# EAGLE design musicbox (EAGLE 9.6.2)
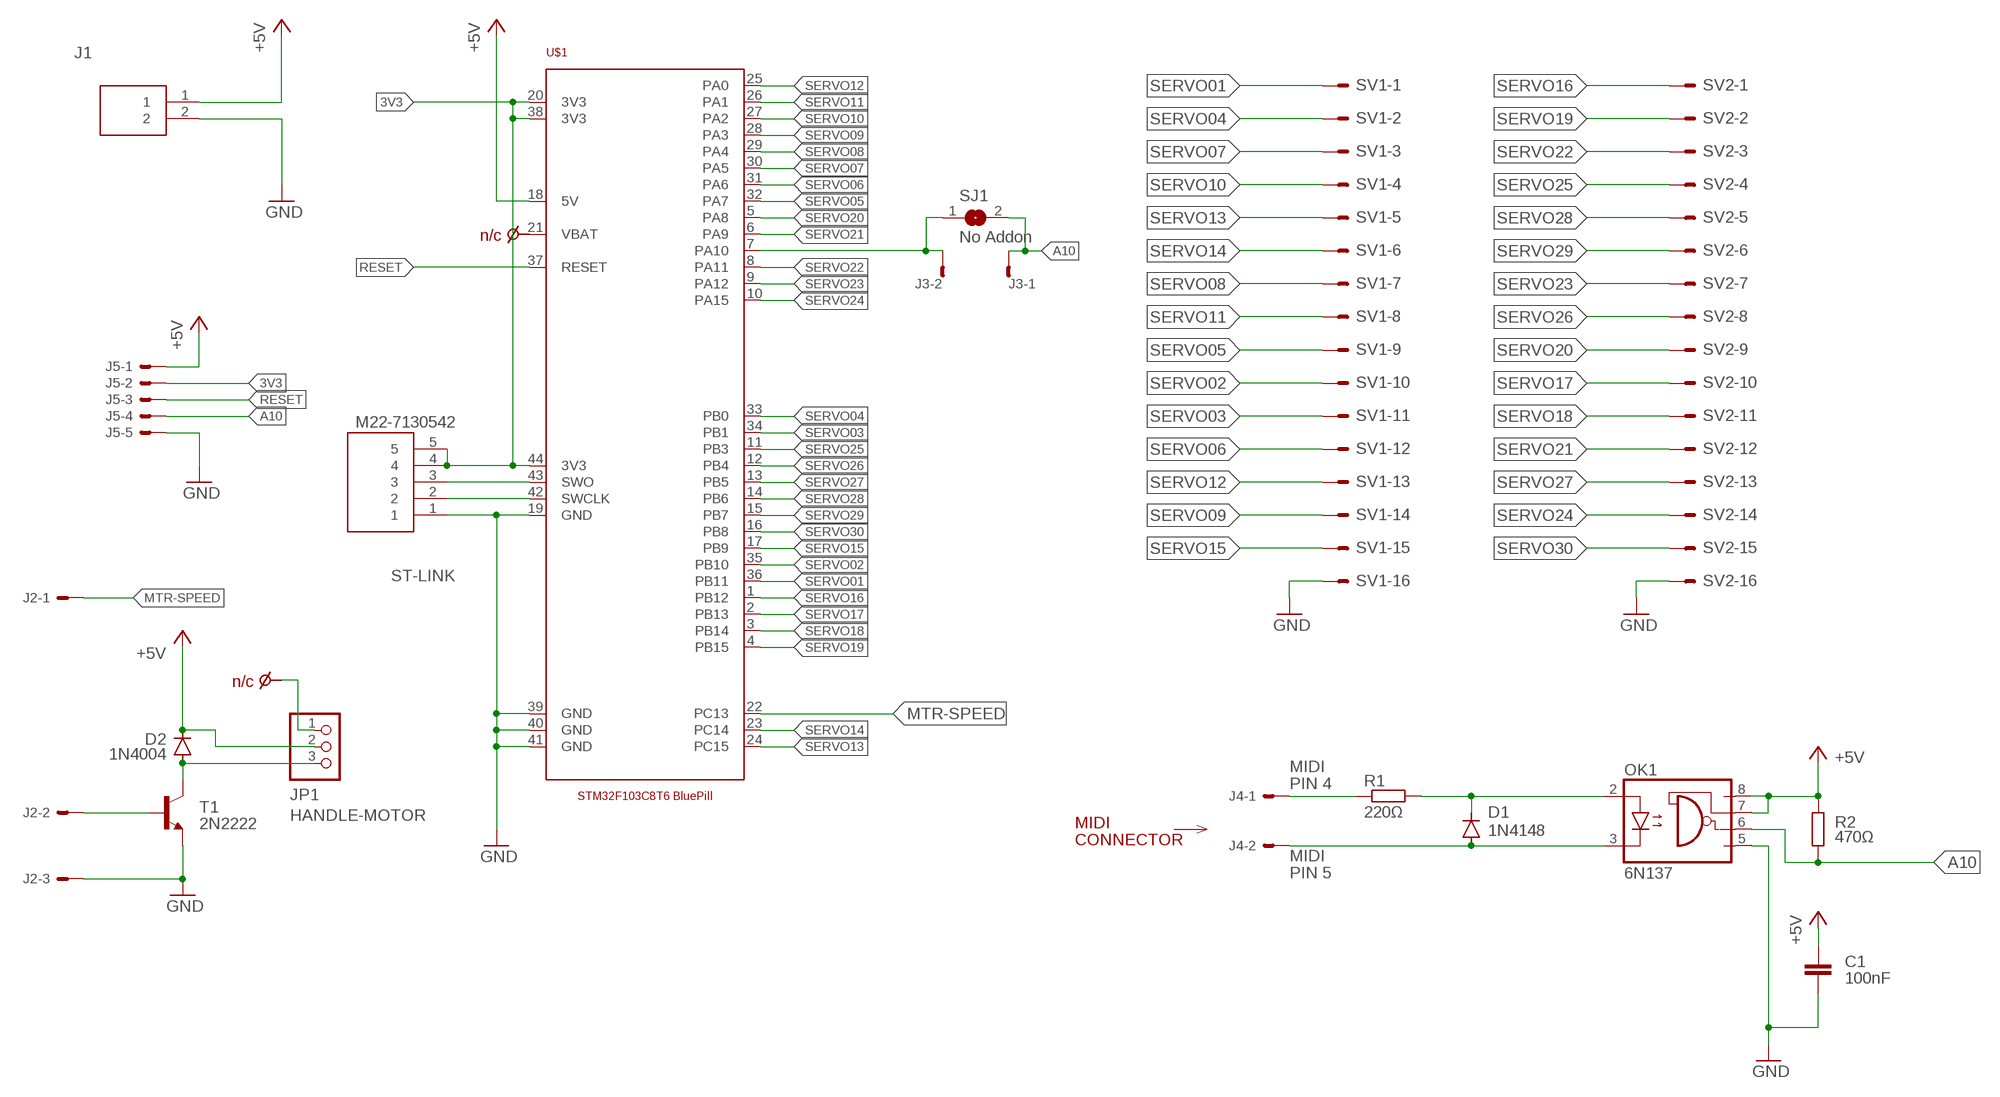
[diagram p0: schematic, sheet 1]

## Parts
C1  100nF  C-EU025-025X050  [C025-025X050]
D1  1N4148  1N4148DO35-7  [DO35-7]
D2  1N4004  [DO41-10]
J1  1727010  [1727010]
J2  22-27-2031-03  [6410-03]
J3  22-27-2021-02  [6410-02]
J4  22-27-2021-02  [6410-02]
J5  22-27-2051-05  [6410-05]
JP1  HANDLE-MOTOR  PINHD-1X3  [1X03]
OK1  6N137  [DIL08]
R1  220Ω  R-EU_0207/7  [0207/7]
R2  470Ω  R-EU_0207/7  [0207/7]
SJ1  No Addon  SJW  [SJW]
ST-LINK  M22-7130542  [RHDR5W50P0X200_1X5_1050X240X44]
SV1  Servos 01-15  ML16E  [ML16]
SV2  Servos 16-30  ML16E  [ML16]
T1  2N2222  2N3904  [TO92]
U$1  STM32F103C8T6BLUEPILL  [STM32F103C8T6]
U$3  N/C-ALT-WITH-TEXT  (no package)
U$5  N/C-ALT-WITH-TEXT  (no package)

## Nets
3V3: J5.2 ST-LINK.4 ST-LINK.5 U$1.20(3V3) U$1.38(3V3) U$1.44(3V3)
+5V: C1.1 D2.C J1.1 J5.1 JP1.2 OK1.7(VE) OK1.8(VCC) R2.2 U$1.18(5V)
A10: J3.1 J5.4 OK1.6(VO) R2.1 SJ1.2
CLK: ST-LINK.2 U$1.42(SWCLK)
DIO: ST-LINK.3 U$1.43(SWO)
GND: C1.2 J1.2 J2.3 J5.5 OK1.5(GND) ST-LINK.1 SV1.16 SV2.16 T1.3(E) U$1.19(GND) U$1.39(GND) U$1.40(GND) U$1.41(GND)
MTR-SPEED: J2.1 U$1.22(PC13)
N$1: J2.2 T1.2(B)
N$2: J4.1 R1.1
N$3: D2.A JP1.3 T1.1(C)
N$4: JP1.1 U$3.P$1
N$5: D1.A J4.2 OK1.3(C)
N$7: D1.C OK1.2(A) R1.2
N$9: U$1.21(VBAT) U$5.P$1
N$15: J3.2 SJ1.1 U$1.7(PA10)
RESET: J5.3 U$1.37(RESET)
SERVO01: SV1.1 U$1.36(PB11)
SERVO02: SV1.10 U$1.35(PB10)
SERVO03: SV1.11 U$1.34(PB1)
SERVO04: SV1.2 U$1.33(PB0)
SERVO05: SV1.9 U$1.32(PA7)
SERVO06: SV1.12 U$1.31(PA6)
SERVO07: SV1.3 U$1.30(PA5)
SERVO08: SV1.7 U$1.29(PA4)
SERVO09: SV1.14 U$1.28(PA3)
SERVO10: SV1.4 U$1.27(PA2)
SERVO11: SV1.8 U$1.26(PA1)
SERVO12: SV1.13 U$1.25(PA0)
SERVO13: SV1.5 U$1.24(PC15)
SERVO14: SV1.6 U$1.23(PC14)
SERVO15: SV1.15 U$1.17(PB9)
SERVO16: SV2.1 U$1.1(PB12)
SERVO17: SV2.10 U$1.2(PB13)
SERVO18: SV2.11 U$1.3(PB14)
SERVO19: SV2.2 U$1.4(PB15)
SERVO20: SV2.9 U$1.5(PA8)
SERVO21: SV2.12 U$1.6(PA9)
SERVO22: SV2.3 U$1.8(PA11)
SERVO23: SV2.7 U$1.9(PA12)
SERVO24: SV2.14 U$1.10(PA15)
SERVO25: SV2.4 U$1.11(PB3)
SERVO26: SV2.8 U$1.12(PB4)
SERVO27: SV2.13 U$1.13(PB5)
SERVO28: SV2.5 U$1.14(PB6)
SERVO29: SV2.6 U$1.15(PB7)
SERVO30: SV2.15 U$1.16(PB8)

## Notes on the sheet
- MIDI
  PIN 4
- MIDI
  CONNECTOR
- MIDI
  PIN 5

## Library data of the parts
C1 = rcl:C-EU: CAPACITOR, European symbol; DIGIKEY_PART_NUMBER: BC5142-ND; FARNELL_PART_NUMBER: 2112909; MANUFACTURER_NAME: Vishay / BC Components; MOUSER_PART_NUMBER: 594-K104M15X7RF53L2; SPICEPREFIX: C
D1 = diode:1N4148: DIODE high speed (Philips); DIGIKEY_PART_NUMBER: 1N4148FS-ND; FARNELL_PART_NUMBER: 2322485; MANUFACTURER_NAME: Onsemi / Fairchild; MOUSER_PART_NUMBER: 512-1N4148
D2 = diode:1N4004: DIODE general purpose rectifier, 1 A; DIGIKEY_PART_NUMBER: 1N4004MSCT-ND; FARNELL_PART_NUMBER: 1843708; MANUFACTURER_NAME: Rectron; MOUSER_PART_NUMBER: 583-1N4004-T
J1 = 1727010:1727010: Conn PC Terminal Block 2 POS 3.81mm Solder ST Thru-Hole 13.5A Source: Datasheet <https://datasheet.datasheetarchive.com/originals/distributors/SFDatasheet-2/sf-00050638.pdf>; ARROW_PART_NUMBER: 1727010; ARROW_PRICE-STOCK: https://www.arrow.com/en/products/1727010/phoenix-contact?region=nac; DESCRIPTION: Conn PC Terminal Block 2 POS 3.81mm Solder ST Thru-Hole 13.5A; DIGIKEY_PART_NUMBER: 277-1947-ND; FARNELL_PART_NUMBER: 3704579; HEIGHT: 8.65mm; MANUFACTURER_NAME: Phoenix Contact; MANUFACTURER_PART_NUMBER: 1727010; MOUSER_PART_NUMBER: 651-1727010; MOUSER_PRICE-STOCK: https://www.mouser.co.uk/ProductDetail/Phoenix-Contact/1727010?qs=JcjeNNoqGSMjtHhQoBJ7UA%3D%3D
J2 = con-molex:22-?-03: CONNECTOR wire to board 2.54 mm (.1 inch) pitch header; DIGIKEY_PART_NUMBER: WM4112-ND; FARNELL_PART_NUMBER: 9731156; MANUFACTURER_NAME: Molex; MF: MOLEX; MOUSER_PART_NUMBER: 538-22-27-2031; OC_FARNELL: unknown; OC_NEWARK: unknown
J3 J4 = con-molex:22-?-02: CONNECTOR wire to board 2.54 mm (.1 inch) pitch header; DIGIKEY_PART_NUMBER: WM4111-ND; FARNELL_PART_NUMBER: 9731148; MANUFACTURER_NAME: Molex; MF: MOLEX; MOUSER_PART_NUMBER: 538-22-27-2021; OC_FARNELL: unknown; OC_NEWARK: unknown
J5 = con-molex:22-?-05: CONNECTOR wire to board 2.54 mm (.1 inch) pitch header; DIGIKEY_PART_NUMBER: WM4114-ND; FARNELL_PART_NUMBER: 9731679; MANUFACTURER_NAME: Molex; MF: MOLEX; MOUSER_PART_NUMBER: 538-22-27-2051; OC_FARNELL: unknown; OC_NEWARK: unknown
JP1 = pinhead:PINHD-1X3: PIN HEADER; DIGIKEY_PART_NUMBER: 68004-403-ND; FARNELL_PART_NUMBER: 3881564; MANUFACTURER_NAME: Amphenol FCI; MOUSER_PART_NUMBER: 651-1012937890301BLF
OK1 = optocoupler:6N137: MOTOROLA OPTO COUPLER; DIGIKEY_PART_NUMBER: 160-1791-ND; FARNELL_PART_NUMBER: 1328376; MANUFACTURER_NAME: Lite-On; MOUSER_PART_NUMBER: 859-6N137; MPN: 6N137; OC_FARNELL: 1328376; OC_NEWARK: 52M1895
R1 = rcl:R-EU_: RESISTOR, European symbol; DIGIKEY_PART_NUMBER: BC3666CT-ND; FARNELL_PART_NUMBER: 3546954; MANUFACTURER_NAME: Vishay / Beyschlag; MOUSER_PART_NUMBER: 594-MBB02070C2200FCT; SPICEPREFIX: R
R2 = rcl:R-EU_: RESISTOR, European symbol; DIGIKEY_PART_NUMBER: BC3790CT-ND; FARNELL_PART_NUMBER: 3547014; MANUFACTURER_NAME: Vishay / Beyschlag; MOUSER_PART_NUMBER: 594-MBB02070C4700FCT; SPICEPREFIX: R
SJ1 = jumper:SJ: SMD solder JUMPER
ST-LINK = M22-7130542:M22-7130542: 2mm pitch, SIL vertical socket assembly, 5 position Source: Datasheet <https://cdn.harwin.com/pdfs/M22-713.pdf>; DESCRIPTION: 2mm pitch, SIL vertical socket assembly, 5 position; DIGIKEY_PART_NUMBER: 952-1352-5-ND; FARNELL_PART_NUMBER: 1109729; HEIGHT: 4.4mm; MANUFACTURER_NAME: Harwin; MANUFACTURER_PART_NUMBER: M22-7130542; MOUSER_PART_NUMBER: 855-M22-7130542; MOUSER_PRICE-STOCK: https://www.mouser.co.uk/ProductDetail/Harwin/M22-7130542?qs=Jph8NoUxIfVEgwGbmzmPjA%3D%3D
SV1 SV2 = con-harting-ml:ML16?E: HARTING; DIGIKEY_PART_NUMBER: 1195-1694-ND; FARNELL_PART_NUMBER: 1106834; MANUFACTURER_NAME: Harting; MOUSER_PART_NUMBER: 617-09185166324; OC_FARNELL: unknown; OC_NEWARK: unknown
T1 = transistor-neu-to92:2N3904: NPN TRANSISTOR; DIGIKEY_PART_NUMBER: KSP2222ABUFS-ND; FARNELL_PART_NUMBER: 1700711; MANUFACTURER_NAME: Diotec Semiconductors; MOUSER_PART_NUMBER: 637-2N2222A
U$1 = STM32F103C8T6-Blue_Pill:STM32F103C8T6
U$3 U$5 = nc-pin:N/C-ALT-WITH-TEXT: N/C Symbol With Label With Pin-Leg Alternative Symbol Slash-Notation; _EXTERNAL_: n/c

## Board
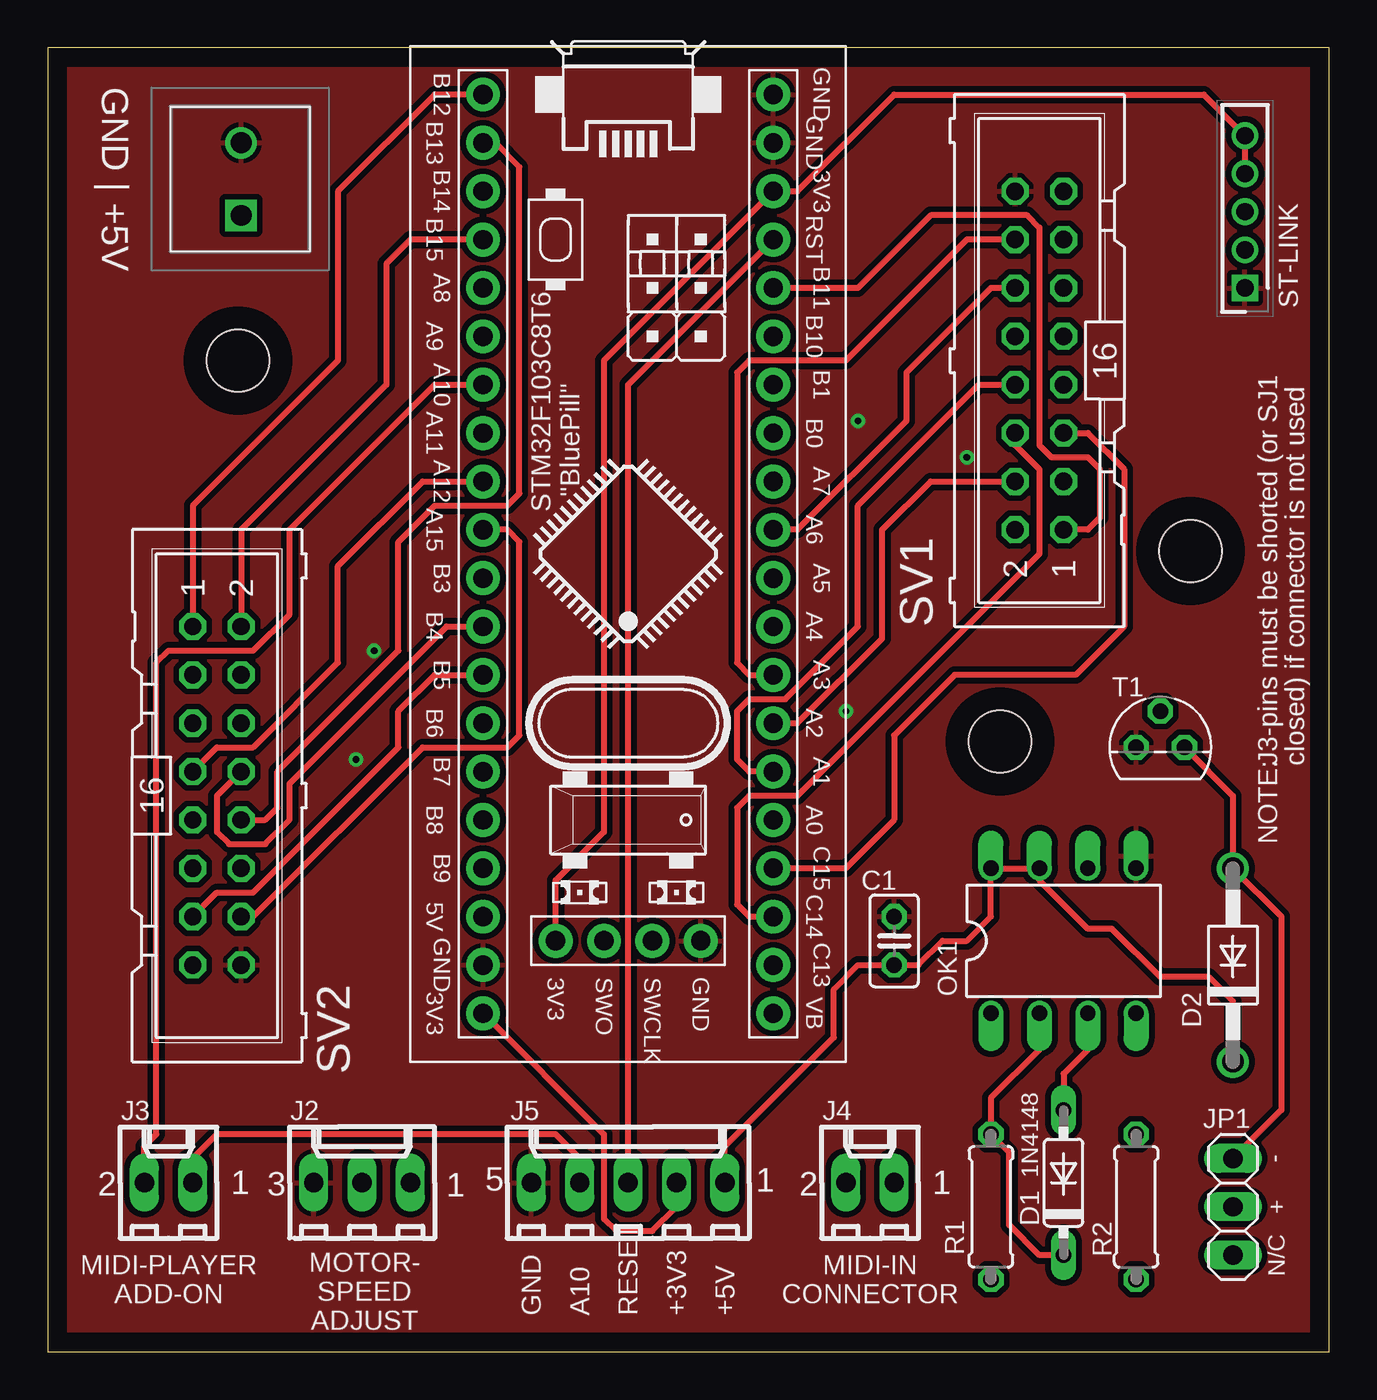
[diagram p1: board, top side]
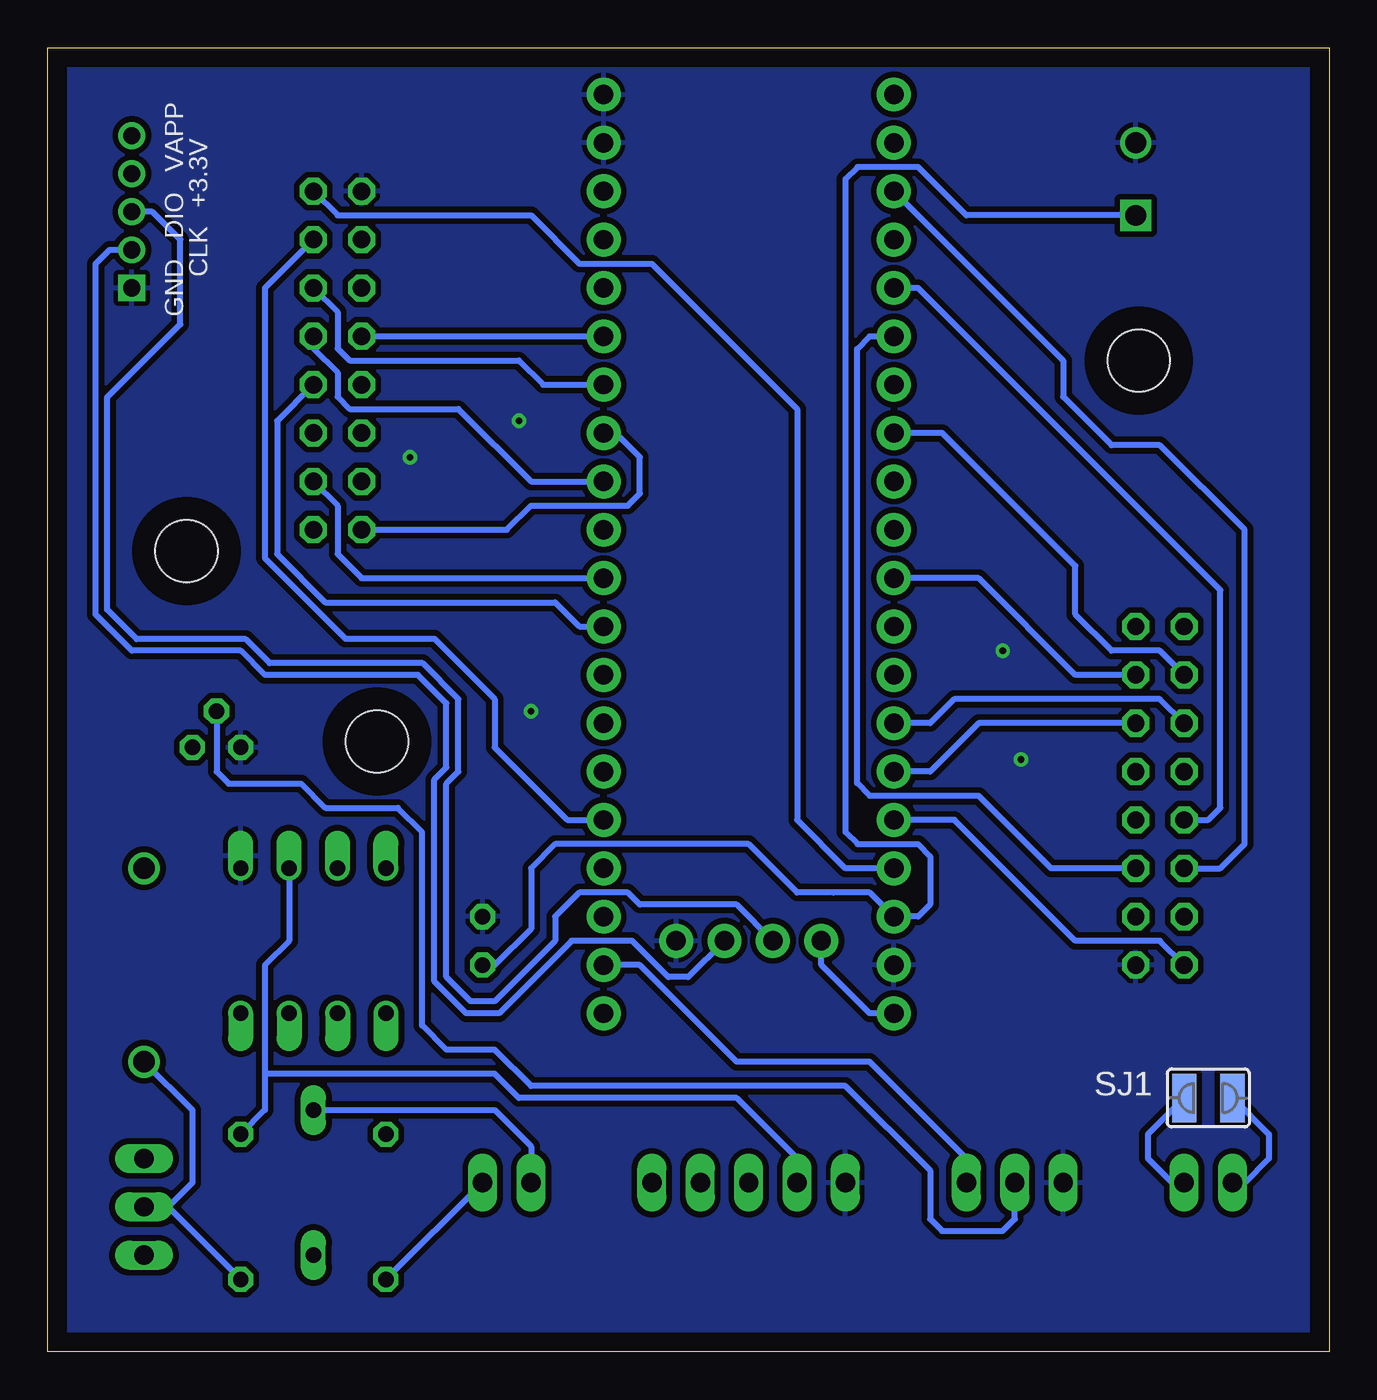
[diagram p2: board, bottom side, seen from below]

Size 67.29 x 68.5 mm. Coordinates in mm from the lower left corner, seen from the top.
Outline: 0,0 67.29,0 67.29,68.5 0,68.5 0,0
Copper layers (1*16): Top 0.035mm / dielectric 1.5mm / Bottom 0.035mm
Design rules "default *": minimum track width 6mil, minimum drill 0.35mm, track to track 12mil, track to pad 6mil, pad to pad 6mil, via to via 6mil, smd to smd 6mil, copper to edge 40mil, drill to drill 6mil, minimum pad ring 10mil, minimum via ring 8mil, stop-mask expansion 4mil, vias tented up to drill 0mil, thermal gap 10mil
Holes 3.28 mm at 10,52.06 50,32.06 60,42.06
tRestrict: area 7.2,49.2 to 12.8,54.9; area 47.2,29.2 to 52.8,34.9; area 57.2,39.2 to 62.8,44.9
bRestrict: area 7.2,49.2 to 12.8,54.9; area 47.2,29.2 to 52.8,34.9; area 57.2,39.2 to 62.8,44.9

### Footprints (pad centres in the part's own frame; a part is rotated, then mirrored left to right if it is on the bottom)
C025-025X050 = drill 0.813 octagon: 1 -1.27,0; 2 1.27,0
DO35-7 = drill 0.813 long: A 3.81,0; C -3.81,0
DO41-10 = drill 1.118: A 5.08,0; C -5.08,0
1727010 = drill 1.1 pad 1.65 square: 1 0,0 | drill 1.1 pad 1.65: 2 3.81,0
6410-03 = drill 1.016 long: 1 2.54,0; 2 0,0; 3 -2.54,0
6410-02 = drill 1.016 long: 1 1.27,0; 2 -1.27,0
6410-05 = drill 1.016 long: 1 5.08,0; 2 2.54,0; 3 0,0; 4 -2.54,0; 5 -5.08,0
1X03 = drill 1.016 long: 1 -2.54,0; 2 0,0; 3 2.54,0
DIL08 = drill 0.813 offset: 1 -3.81,-3.81; 2 -1.27,-3.81; 3 1.27,-3.81; 4 3.81,-3.81; 5 3.81,3.81; 6 1.27,3.81; 7 -1.27,3.81; 8 -3.81,3.81
0207/7 = drill 0.813 octagon: 1 -3.81,0; 2 3.81,0
SJW = smd 1.27 x 2.54: 1 -1.27,0; 2 1.27,0
RHDR5W50P0X200_1X5_1050X240X44 = drill 0.9 pad 1.35 square: 1 0,0 | drill 0.9 pad 1.35: 2 2,0; 3 4,0; 4 6,0; 5 8,0
ML16 = drill 0.914 octagon: 1 -8.89,-1.27; 2 -8.89,1.27; 3 -6.35,-1.27; 4 -6.35,1.27; 5 -3.81,-1.27; 6 -3.81,1.27; 7 -1.27,-1.27; 8 -1.27,1.27; 9 1.27,-1.27; 10 1.27,1.27; 11 3.81,-1.27; 12 3.81,1.27; 13 6.35,-1.27; 14 6.35,1.27; 15 8.89,-1.27; 16 8.89,1.27
TO92 = drill 0.813 octagon: 1 1.27,0; 2 0,1.905; 3 -1.27,0
STM32F103C8T6 = drill 1.016 pad 1.778: 1 -7.62,24.13; 2 -7.62,21.59; 3 -7.62,19.05; 4 -7.62,16.51; 5 -7.62,13.97; 6 -7.62,11.43; 7 -7.62,8.89; 8 -7.62,6.35; 9 -7.62,3.81; 10 -7.62,1.27; 11 -7.62,-1.27; 12 -7.62,-3.81; 13 -7.62,-6.35; 14 -7.62,-8.89; 15 -7.62,-11.43; 16 -7.62,-13.97; 17 -7.62,-16.51; 18 -7.62,-19.05; 19 -7.62,-21.59; 20 -7.62,-24.13; 21 7.62,-24.13; 22 7.62,-21.59; 23 7.62,-19.05; 24 7.62,-16.51; 25 7.62,-13.97; 26 7.62,-11.43; 27 7.62,-8.89; 28 7.62,-6.35; 29 7.62,-3.81; 30 7.62,-1.27; 31 7.62,1.27; 32 7.62,3.81; 33 7.62,6.35; 34 7.62,8.89; 35 7.62,11.43; 36 7.62,13.97; 37 7.62,16.51; 38 7.62,19.05; 39 7.62,21.59; 40 7.62,24.13; 41 3.81,-20.32; 42 1.27,-20.32; 43 -1.27,-20.32; 44 -3.81,-20.32

### Placement (x,y rotation side)
C1  44.45,21.59 90 top
D1  53.34,8.89 90 top
D2  62.23,20.32 90 top
J1  10.16,59.69 90 top
J2  16.51,8.89 0 top
J3  6.35,8.89 0 top
J4  43.18,8.89 0 top
J5  30.48,8.89 0 top
JP1  62.23,7.62 90 top
OK1  53.34,21.59 0 top
R1  49.53,7.62 90 top
R2  57.15,7.62 270 top
SJ1  6.35,13.33 180 bottom
ST-LINK  62.87,55.88 90 top
SV1  52.07,52.07 90 top
SV2  8.89,29.21 270 top
T1  58.42,31.75 0 top
U$1  30.48,41.91 0 top

### Tracks (layer width: path | path; a pad name or v marks a point on that pad's centre or on a via)
3V3
  Top 0.305: U$1.20 29.21,11.43 29.21,6.98 29.84,6.35 31.75,6.35 33.02,7.62 J5.2 | U$1.44 26.67,24.76 29.21,27.3 29.21,52.07 U$1.38 39.37,60.96 44.45,66.04 60.7,66.04 ST-LINK.5 ST-LINK.4
  Bottom 0.305: U$1.20 24.13,17.78 26.67,20.32 U$1.44
+5V
  Top 0.305: D2.C 62.23,18.41 60.96,19.68 58.42,19.68 55.88,22.22 54.61,22.22 52.07,24.76 OK1.7 OK1.8 49.53,22.86 48.26,21.59 46.99,21.59 45.72,20.32 C1.1 42.55,20.32 41.27,19.05 41.27,16.51 35.56,10.79 J5.1
  Bottom 0.305: J1.1 19.05,59.69 21.59,62.23 24.77,62.23 25.4,61.59 25.4,27.3 24.77,26.67 21.59,26.67 20.95,26.04 20.95,23.5 21.59,22.86 U$1.18 24.13,24.13 26.04,24.13 27.94,24.13 30.48,26.67 40.64,26.67 41.91,25.4 41.91,22.22 43.81,20.32 C1.1 | R2.2 60.96,7.62 | 60.96,7.62 JP1.2 | D2.C 59.69,12.7 59.69,8.89 60.96,7.62
A10
  Top 0.305: J5.4 27.94,10.16 26.67,11.43 8.89,11.43 7.62,10.16 J3.1
  Bottom 0.305: R2.1 55.88,12.7 55.88,14.61 | OK1.6 54.61,21.59 55.88,20.32 55.88,14.61 | J5.4 27.94,10.16 31.11,13.33 42.55,13.33 43.81,14.61 55.88,14.61 | SJ1.2 9.53,11.43 9.53,10.16 8.26,8.89 J3.1
CLK
  Bottom 0.305: U$1.42 33.66,19.68 34.7,19.68 36.6,21.59 39.78,21.59 43.59,17.78 45.31,17.78 46.99,19.46 46.99,30.07 46.35,30.71 46.35,34.06 47.85,35.56 55.88,35.56 57.15,36.83 62.87,36.83 64.77,38.73 64.77,57.15 64.04,57.88 ST-LINK.2
DIO
  Bottom 0.305: U$1.43 31.11,23.5 36.2,23.5 36.83,24.13 39.37,24.13 40.64,22.86 40.64,21.59 43.81,18.41 45.09,18.41 46.35,19.68 46.35,29.84 45.72,30.48 45.72,34.29 47.6,36.17 55.63,36.17 56.9,37.44 62.61,37.44 64.16,38.99 64.16,50.14 60.33,53.98 60.33,58.42 61.78,59.88 ST-LINK.3
GND  (via drill 0.35)
  other vias: 42.55,48.89 41.91,33.66 48.26,46.99 17.14,36.83 16.19,31.11
  pour Top: -1.27,69.85 68.58,69.85 68.58,-2.54 -1.27,-2.54
  pour Bottom: -1.27,69.85 68.58,69.85 68.58,-2.54 -1.27,-2.54
MTR-SPEED
  Bottom 0.305: J2.1 19.05,10.16 24.13,15.24 31.11,15.24 36.2,20.32 U$1.22
N$1
  Bottom 0.305: T1.2 58.42,30.48 57.78,29.84 53.98,29.84 52.7,28.57 48.9,28.57 47.62,27.3 47.62,17.14 46.35,15.87 43.81,15.87 41.91,13.97 25.4,13.97 20.95,9.53 20.95,6.98 20.32,6.35 17.14,6.35 16.51,6.98 J2.2
N$2
  Bottom 0.305: J4.1 R1.1
N$3
  Top 0.305: T1.1 62.23,29.21 D2.A 64.77,22.86 64.77,12.7 JP1.3
N$5
  Top 0.305: OK1.3 54.61,15.87 53.34,14.61 D1.A
  Bottom 0.305: D1.A 43.81,12.7 41.91,10.79 J4.2
N$7
  Top 0.305: D1.C 52.07,5.08 50.48,6.67 50.48,10.48 R1.2 49.53,13.33 52.07,15.87 OK1.2
N$15
  Top 0.305: J3.2 5.08,10.79 5.71,11.43 5.71,36.2 6.35,36.83 10.79,36.83 12.7,38.73 12.7,43.18 20.32,50.8 U$1.7
  Bottom 0.305: SJ1.1 3.17,11.43 3.17,10.16 4.45,8.89 J3.2
RESET
  Top 0.305: J5.3 30.48,50.8 U$1.37
SERVO01
  Top 0.305: U$1.36 42.55,55.88 46.35,59.69 51.44,59.69 52.07,59.06 52.07,47.62 52.7,46.99 54.61,46.99 55.24,46.36 55.24,43.81 54.61,43.18 SV1.1
SERVO02
  Bottom 0.305: SV1.10 U$1.35
SERVO03
  Bottom 0.305: SV1.11 52.07,54.61 52.07,52.7 51.44,52.07 42.55,52.07 41.27,50.8 U$1.34
SERVO04
  Bottom 0.305: SV1.2 43.18,43.18 41.91,44.45 36.83,44.45 36.2,45.09 36.2,46.99 37.47,48.26 U$1.33
SERVO05
  Bottom 0.305: SV1.9 53.34,52.7 52.07,51.44 52.07,50.17 51.44,49.53 45.72,49.53 41.91,45.72 U$1.32
SERVO06
  Top 0.305: SV1.12 49.53,55.88 45.09,51.44 45.09,48.89 39.37,43.18 U$1.31
SERVO07
  Bottom 0.305: SV1.3 52.07,44.45 52.07,41.91 50.8,40.64 U$1.30
SERVO08
  Bottom 0.305: SV1.7 55.24,48.89 55.24,41.91 52.7,39.37 40.64,39.37 39.37,38.1 U$1.29
SERVO09
  Top 0.305: SV1.14 48.26,58.42 41.91,52.07 36.83,52.07 36.2,51.44 36.2,36.2 36.83,35.56 U$1.28
SERVO10
  Top 0.305: U$1.27 39.37,33.02 43.81,37.47 43.81,43.18 46.35,45.72 SV1.4
SERVO11
  Top 0.305: U$1.26 36.83,30.48 36.2,31.11 36.2,33.66 36.83,34.29 38.73,34.29 42.55,38.1 42.55,44.45 48.9,50.8 SV1.8
SERVO12
  Bottom 0.305: SV1.13 55.88,55.88 55.88,41.68 51.66,37.47 46.99,37.47 43.81,34.29 43.81,31.75 40.01,27.94 U$1.25
SERVO13
  Top 0.305: SV1.5 54.61,48.26 56.52,46.36 56.52,38.1 53.98,35.56 47.62,35.56 44.45,32.39 44.45,27.94 41.91,25.4 U$1.24
SERVO14
  Top 0.305: SV1.6 50.8,47.62 52.07,46.36 52.07,41.91 39.37,29.21 36.83,29.21 36.2,28.57 36.2,23.5 36.83,22.86 U$1.23
SERVO15
  Bottom 0.305: SV1.15 52.07,59.69 41.91,59.69 39.37,57.15 35.56,57.15 27.94,49.53 27.94,27.94 25.4,25.4 U$1.17
SERVO16
  Top 0.305: U$1.1 20.32,66.04 15.24,60.96 15.24,52.07 7.62,44.45 SV2.1
SERVO17
  Top 0.305: SV2.10 11.43,27.94 12.06,28.57 12.06,30.48 18.41,36.83 18.41,42.55 20.32,44.45 24.13,44.45 24.77,45.09 24.77,62.23 23.5,63.5 U$1.2
SERVO18
  Bottom 0.305: U$1.3 13.97,52.07 13.97,50.17 11.43,47.62 8.89,47.62 4.45,43.18 4.45,26.67 5.71,25.4 SV2.11
SERVO19
  Top 0.305: U$1.4 19.05,58.42 17.78,57.15 17.78,50.8 10.16,43.18 SV2.2
SERVO20
  Bottom 0.305: SV2.9 6.35,27.94 5.71,28.57 5.71,40 21.59,55.88 U$1.5
SERVO21
  Bottom 0.305: SV2.12 14.61,25.4 18.41,29.21 24.13,29.21 24.79,29.87 24.79,52.68 24.13,53.34 U$1.6
SERVO22
  Bottom 0.305: SV2.3 8.89,36.83 11.43,36.83 13.34,38.73 13.34,41.28 20.32,48.26 U$1.8
SERVO23
  Top 0.305: SV2.7 8.89,31.75 10.79,31.75 15.24,36.2 15.24,41.28 19.68,45.72 U$1.9
SERVO24
  Top 0.305: SV2.14 10.79,22.86 19.68,31.75 24.13,31.75 24.77,32.39 24.77,42.55 24.13,43.18 U$1.10
SERVO25
  Bottom 0.305: SV2.4 13.34,35.56 18.41,40.64 U$1.11
SERVO26
  Top 0.305: SV2.8 8.89,29.21 8.89,27.3 9.53,26.67 11.43,26.67 12.7,27.94 12.7,29.84 20.95,38.1 U$1.12
SERVO27
  Top 0.305: SV2.13 8.89,24.13 10.79,24.13 14.61,27.94 18.41,31.75 18.41,33.66 20.32,35.56 U$1.13
SERVO28
  Bottom 0.305: SV2.5 8.89,34.29 19.68,34.29 20.95,33.02 U$1.14
SERVO29
  Bottom 0.305: SV2.6 18.41,33.02 20.95,30.48 U$1.15
SERVO30
  Bottom 0.305: SV2.15 8.89,21.59 13.34,21.59 19.68,27.94 U$1.16

### Text on the board
tPlace: GND / / A10 | RESET / / +3V3 / / +5V
tNames: GND | +5V | STM32F103C8T6 / "BluePill" | J3-pins must be shorted (or SJ1 / closed) if connector is not used | NOTE: | JP1 | - | 1N4148 | + | N/C | MIDI-PLAYER / ADD-ON | MIDI-IN / CONNECTOR | MOTOR- / SPEED / ADJUST
bNames: VAPP | +3.3V | DIO | CLK | GND